# EAGLE schematic keyboard (EAGLE 6.5.0)
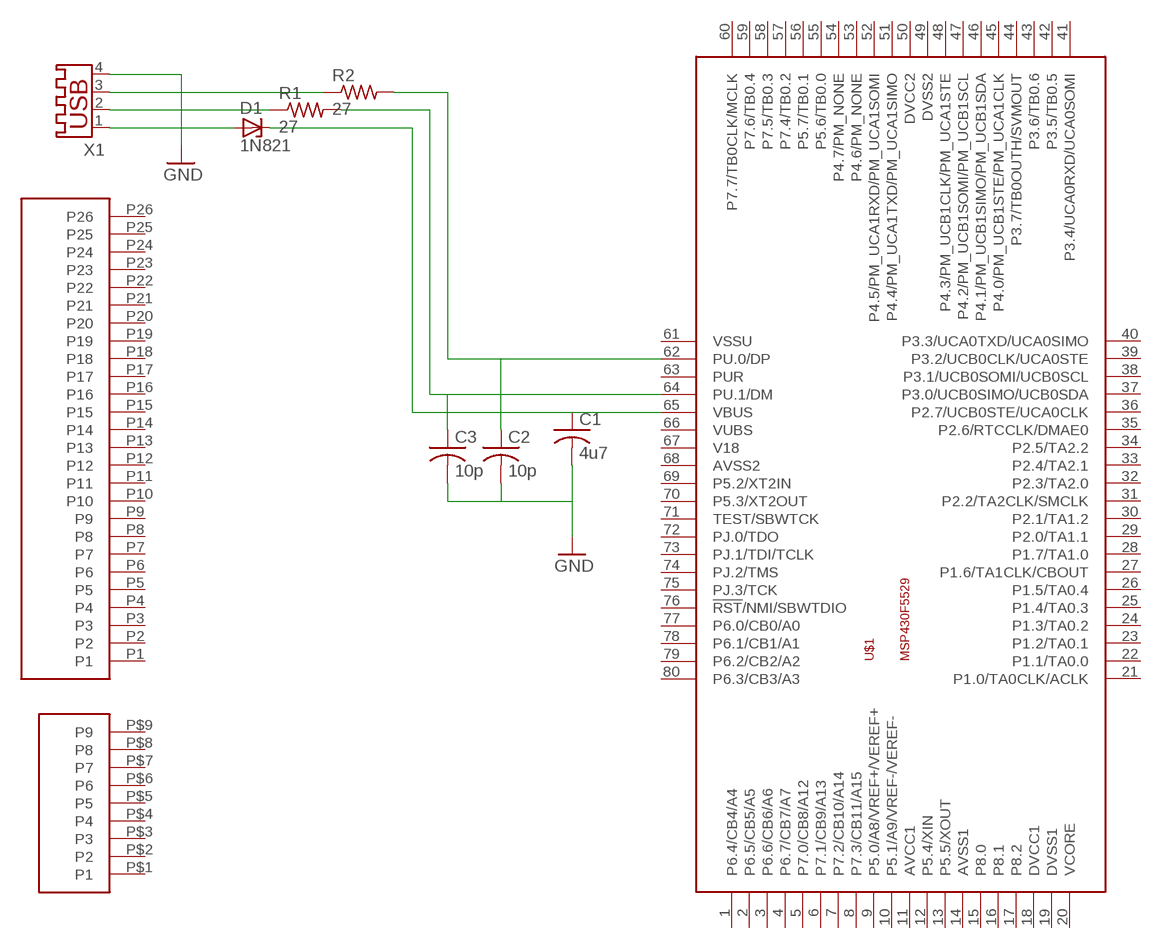
[diagram p0: schematic, sheet 1]

## Parts
C1  4u7  C-USC0805  [C0805]
C2  10p  C-USC0805  [C0805]
C3  10p  C-USC0805  [C0805]
D1  1N821  [DO35Z10]
R1  27  R-US_R0603  [R0603]
R2  27  R-US_R0603  [R0603]
U$1  MSP430F5529  [PN_S-PQFP-G80]
U$2  52808-267126  [SD-52808-025]
U$3  52806-0910  [SD-52806-09]
X1  USB-A003  [USB-A003]

## Nets
GND: C1.2 C2.2 C3.2 X1.4
N$1: C3.1 R1.2 U$1.64(PU.1/DM)
N$2: C2.1 R2.2 U$1.62(PU.0/DP)
N$3: D1.A X1.1
N$4: C1.1 D1.C U$1.65(VBUS)
N$5: R1.1 X1.2
N$6: R2.1 X1.3
Unconnected: U$1.1(P6.4/CB4/A4) U$1.2(P6.5/CB5/A5) U$1.3(P6.6/CB6/A6) U$1.4(P6.7/CB7/A7) U$1.5(P7.0/CB8/A12) U$1.6(P7.1/CB9/A13) U$1.7(P7.2/CB10/A14) U$1.8(P7.3/CB11/A15) U$1.9(P5.0/A8/VREF+/VEREF+) U$1.10(P5.1/A9/VREF-/VEREF-) U$1.11(AVCC1) U$1.12(P5.4/XIN) U$1.13(P5.5/XOUT) U$1.14(AVSS1) U$1.15(P8.0) U$1.16(P8.1) U$1.17(P8.2) U$1.18(DVCC1) U$1.19(DVSS1) U$1.20(VCORE) U$1.21(P1.0/TA0CLK/ACLK) U$1.22(P1.1/TA0.0) U$1.23(P1.2/TA0.1) U$1.24(P1.3/TA0.2) U$1.25(P1.4/TA0.3) U$1.26(P1.5/TA0.4) U$1.27(P1.6/TA1CLK/CBOUT) U$1.28(P1.7/TA1.0) U$1.29(P2.0/TA1.1) U$1.30(P2.1/TA1.2) U$1.31(P2.2/TA2CLK/SMCLK) U$1.32(P2.3/TA2.0) U$1.33(P2.4/TA2.1) U$1.34(P2.5/TA2.2) U$1.35(P2.6/RTCCLK/DMAE0) U$1.36(P2.7/UCB0STE/UCA0CLK) U$1.37(P3.0/UCB0SIMO/UCB0SDA) U$1.38(P3.1/UCB0SOMI/UCB0SCL) U$1.39(P3.2/UCB0CLK/UCA0STE) U$1.40(P3.3/UCA0TXD/UCA0SIMO) U$1.41(P3.4/UCA0RXD/UCA0SOMI) U$1.42(P3.5/TB0.5) U$1.43(P3.6/TB0.6) U$1.44(P3.7/TB0OUTH/SVMOUT) U$1.45(P4.0/PM_UCB1STE/PM_UCA1CLK) U$1.46(P4.1/PM_UCB1SIMO/PM_UCB1SDA) U$1.47(P4.2/PM_UCB1SOMI/PM_UCB1SCL) U$1.48(P4.3/PM_UCB1CLK/PM_UCA1STE) U$1.49(DVSS2) U$1.50(DVCC2) U$1.51(P4.4/PM_UCA1TXD/PM_UCA1SIMO) U$1.52(P4.5/PM_UCA1RXD/PM_UCA1SOMI) U$1.53(P4.6/PM_NONE) U$1.54(P4.7/PM_NONE) U$1.55(P5.6/TB0.0) U$1.56(P5.7/TB0.1) U$1.57(P7.4/TB0.2) U$1.58(P7.5/TB0.3) U$1.59(P7.6/TB0.4) U$1.60(P7.7/TB0CLK/MCLK) U$1.61(VSSU) U$1.63(PUR) U$1.66(VUBS) U$1.67(V18) U$1.68(AVSS2) U$1.69(P5.2/XT2IN) U$1.70(P5.3/XT2OUT) U$1.71(TEST/SBWTCK) U$1.72(PJ.0/TDO) U$1.73(PJ.1/TDI/TCLK) U$1.74(PJ.2/TMS) U$1.75(PJ.3/TCK) U$1.76(!RST!/NMI/SBWTDIO) U$1.77(P6.0/CB0/A0) U$1.78(P6.1/CB1/A1) U$1.79(P6.2/CB2/A2) U$1.80(P6.3/CB3/A3) U$2.P1 U$2.P2 U$2.P3 U$2.P4 U$2.P5 U$2.P6 U$2.P7 U$2.P8 U$2.P9 U$2.P10 U$2.P11 U$2.P12 U$2.P13 U$2.P14 U$2.P15 U$2.P16 U$2.P17 U$2.P18 U$2.P19 U$2.P20 U$2.P21 U$2.P22 U$2.P23 U$2.P24 U$2.P25 U$2.P26 U$3.P$1(P1) U$3.P$2(P2) U$3.P$3(P3) U$3.P$4(P4) U$3.P$5(P5) U$3.P$6(P6) U$3.P$7(P7) U$3.P$8(P8) U$3.P$9(P9)

## Library data of the parts
C1-C3 = rcl:C-US: CAPACITOR, American symbol
D1 = diode:1N821: Reference DIODE temperature compensated, 6,2 V
R1 R2 = rcl:R-US_: RESISTOR, American symbol
U$1 = texas2:MSP430F5529
U$2 = molex-fpc:52808-2671: 26 PIN FPC Connector
U$3 = molex-fpc:52806-0910
X1 = con-yamaichi:USB-A003: USB connector; OC_FARNELL: unknown; OC_NEWARK: unknown